# EAGLE design RTxManualControl (EAGLE 6.5.0)
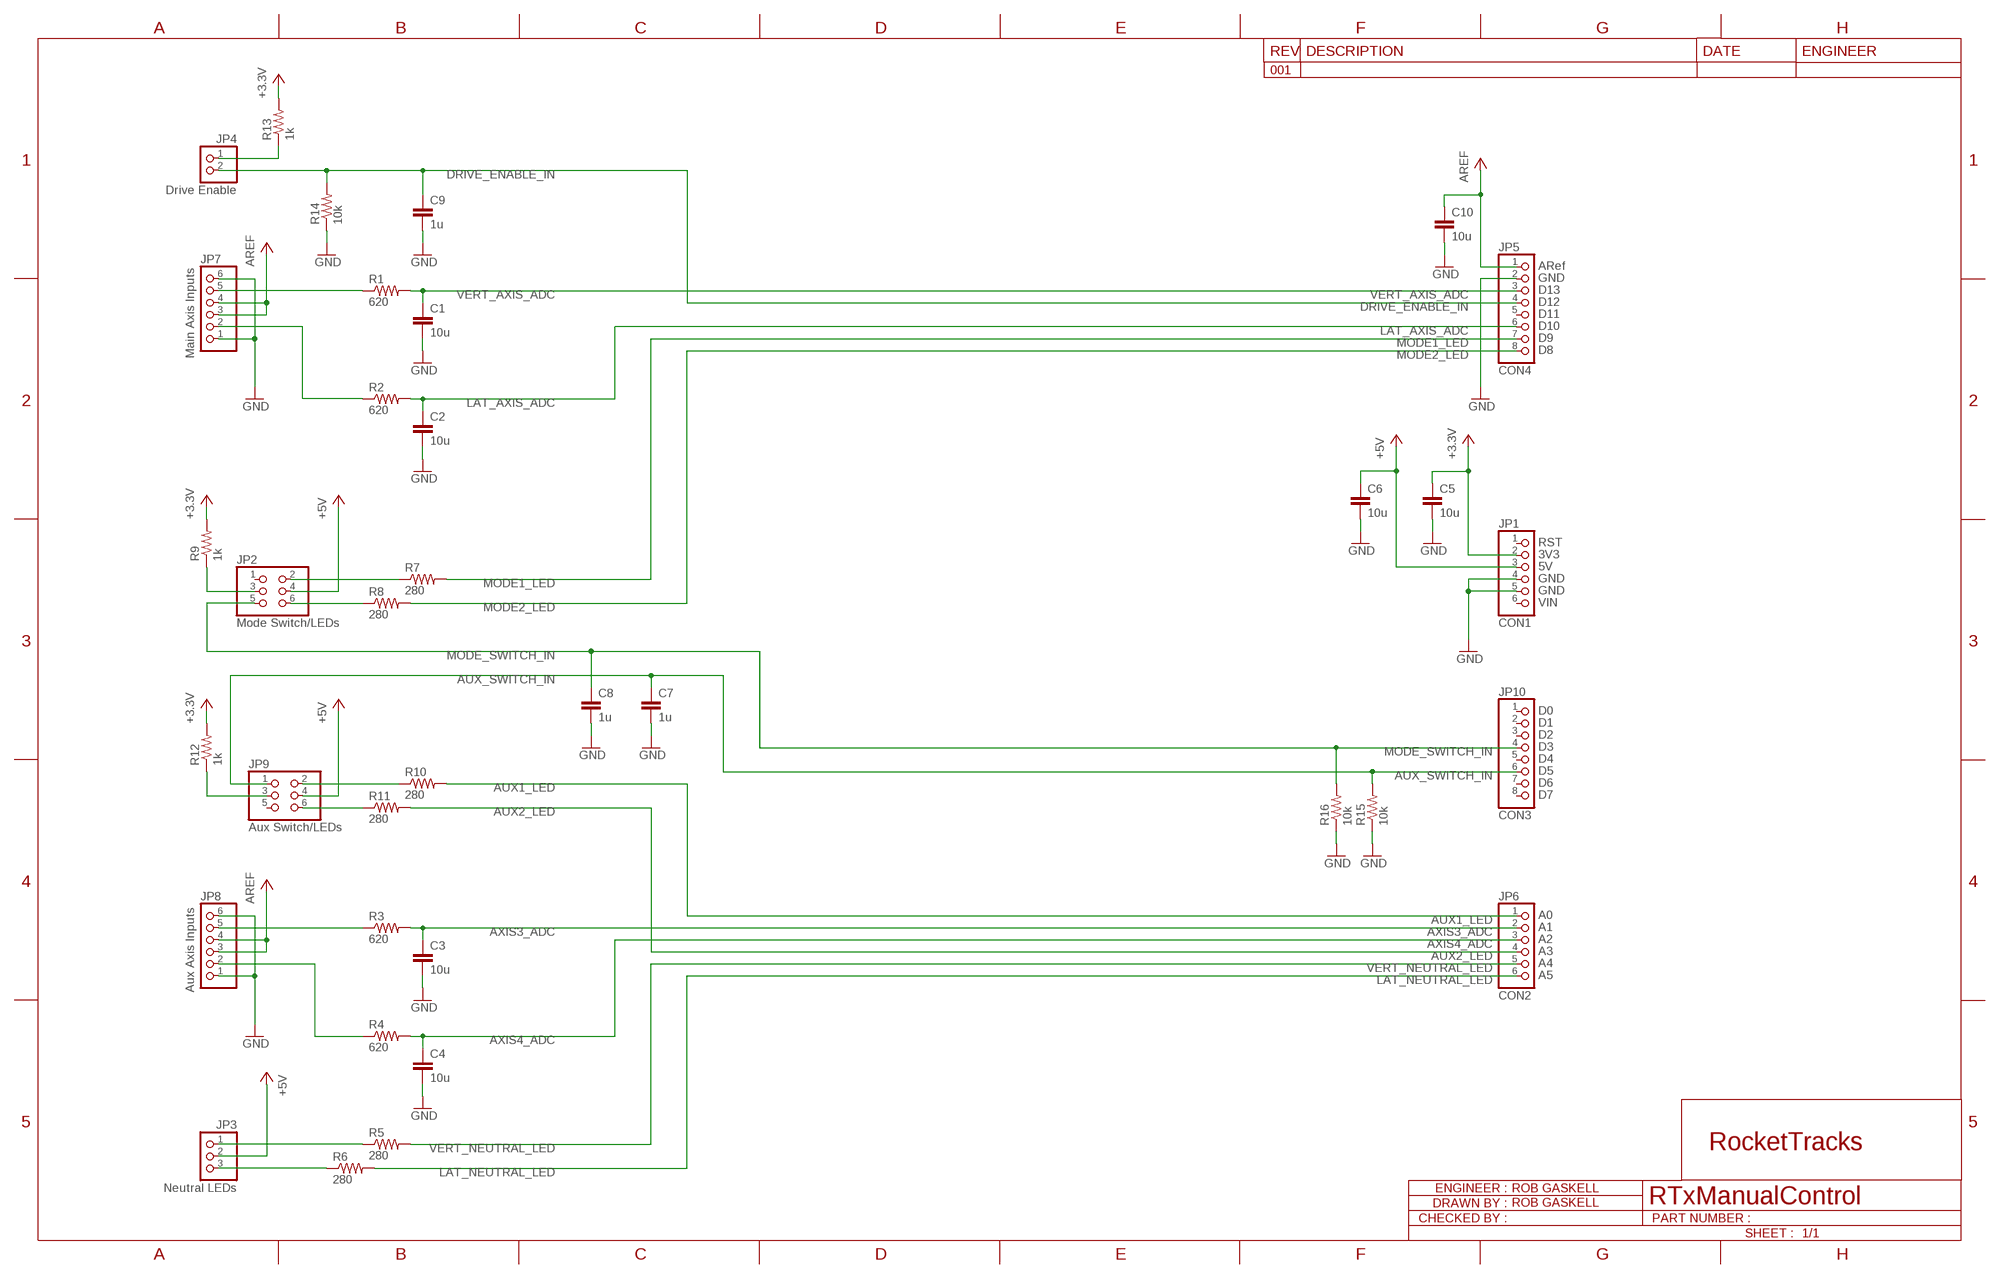
[diagram p0: schematic, sheet 1]

## Parts
C1  10u  C-EUC1206  [C1206]
C2  10u  C-EUC1206  [C1206]
C3  10u  C-EUC1206  [C1206]
C4  10u  C-EUC1206  [C1206]
C5  10u  C-EUC1206  [C1206]
C6  10u  C-EUC1206  [C1206]
C7  1u  C-EUC1206  [C1206]
C8  1u  C-EUC1206  [C1206]
C9  1u  C-EUC1206  [C1206]
C10  10u  C-EUC1206  [C1206]
JP1  CON1  PINHD-1X6  [1X06]
JP2  Mode Switch/LEDs  PINHD-2X3  [2X03]
JP3  Neutral LEDs  PINHD-1X3  [1X03]
JP4  Drive Enable  PINHD-1X2  [1X02]
JP5  CON4  PINHD-1X8  [1X08]
JP6  CON2  PINHD-1X6  [1X06]
JP7  Main Axis Inputs  PINHD-1X6  [1X06]
JP8  Aux Axis Inputs  PINHD-1X6  [1X06]
JP9  Aux Switch/LEDs  PINHD-2X3  [2X03]
JP10  CON3  PINHD-1X8  [1X08]
R1  620  R-US_R1206  [R1206]
R2  620  R-US_R1206  [R1206]
R3  620  R-US_R1206  [R1206]
R4  620  R-US_R1206  [R1206]
R5  280  R-US_R1206  [R1206]
R6  280  R-US_R1206  [R1206]
R7  280  R-US_R1206  [R1206]
R8  280  R-US_R1206  [R1206]
R9  1k  R-US_R1206  [R1206]
R10  280  R-US_R1206  [R1206]
R11  280  R-US_R1206  [R1206]
R12  1k  R-US_R1206  [R1206]
R13  1k  R-US_R1206  [R1206]
R14  10k  R-US_R1206  [R1206]
R15  10k  R-US_R1206  [R1206]
R16  10k  R-US_R1206  [R1206]

## Nets
+3.3V: C5.1 JP1.2 R9.2 R12.2 R13.2
+5V: C6.1 JP1.3 JP2.4 JP3.2 JP9.4
AREF: C10.1 JP5.1 JP7.3 JP7.4 JP8.3 JP8.4
AUX1_LED: JP6.1 R10.2
AUX1_LED_CONN: JP9.2 R10.1
AUX2_LED: JP6.4 R11.2
AUX2_LED_CONN: JP9.6 R11.1
AUX_SWITCH_IN: C7.1 JP9.1 JP10.6 R15.2
AUX_SWITCH_PULLUP: JP9.3 R12.1
AXIS3_ADC: C3.1 JP6.2 R3.2
AXIS3_CONN: JP8.5 R3.1
AXIS4_ADC: C4.1 JP6.3 R4.2
AXIS4_CONN: JP8.2 R4.1
DRIVE_ENABLE_IN: C9.1 JP4.2 JP5.4 R14.2
DRIVE_ENABLE_PULLUP: JP4.1 R13.1
GND: C1.2 C2.2 C3.2 C4.2 C5.2 C6.2 C7.2 C8.2 C9.2 C10.2 JP1.4 JP1.5 JP5.2 JP7.1 JP7.6 JP8.1 JP8.6 R14.1 R15.1 R16.1
LAT_AXIS_ADC: C2.1 JP5.6 R2.2
LAT_AXIS_CONN: JP7.2 R2.1
LAT_NEAUTRAL_LED_CONN: JP3.3 R6.1
LAT_NEUTRAL_LED: JP6.6 R6.2
MODE1_LED: JP5.7 R7.2
MODE1_LED_CONN: JP2.2 R7.1
MODE2_LED: JP5.8 R8.2
MODE2_LED_CONN: JP2.6 R8.1
MODE_SWITCH_IN: C8.1 JP2.5 JP10.4 R16.2
MODE_SWITCH_PULLUP: JP2.3 R9.1
VERT_AXIS_ADC: C1.1 JP5.3 R1.2
VERT_AXIS_CONN: JP7.5 R1.1
VERT_NEUTRAL_LED: JP6.5 R5.2
VERT_NEUTRAL_LED_CONN: JP3.1 R5.1
Unconnected: JP1.1 JP1.6 JP2.1 JP5.5 JP9.5 JP10.1 JP10.2 JP10.3 JP10.5 JP10.7 JP10.8

## Notes on the sheet
- ARef
- GND
- D13
- D12
- D11
- D10
- D9
- D8
- RST
- 3V3
- 5V
- GND
- GND
- VIN
- D0
- D1
- D2
- D3
- D4
- D5
- D6
- D7
- A0
- A1
- A2
- A3
- A4
- A5

## Library data of the parts
C1-C10 = rcl:C-EU: CAPACITOR, European symbol
JP1 JP6-JP8 = pinhead:PINHD-1X6: PIN HEADER
JP2 JP9 = pinhead:PINHD-2X3: PIN HEADER
JP3 = pinhead:PINHD-1X3: PIN HEADER
JP4 = pinhead:PINHD-1X2: PIN HEADER
JP5 JP10 = pinhead:PINHD-1X8: PIN HEADER
R1-R16 = rcl:R-US_: RESISTOR, American symbol

## Board
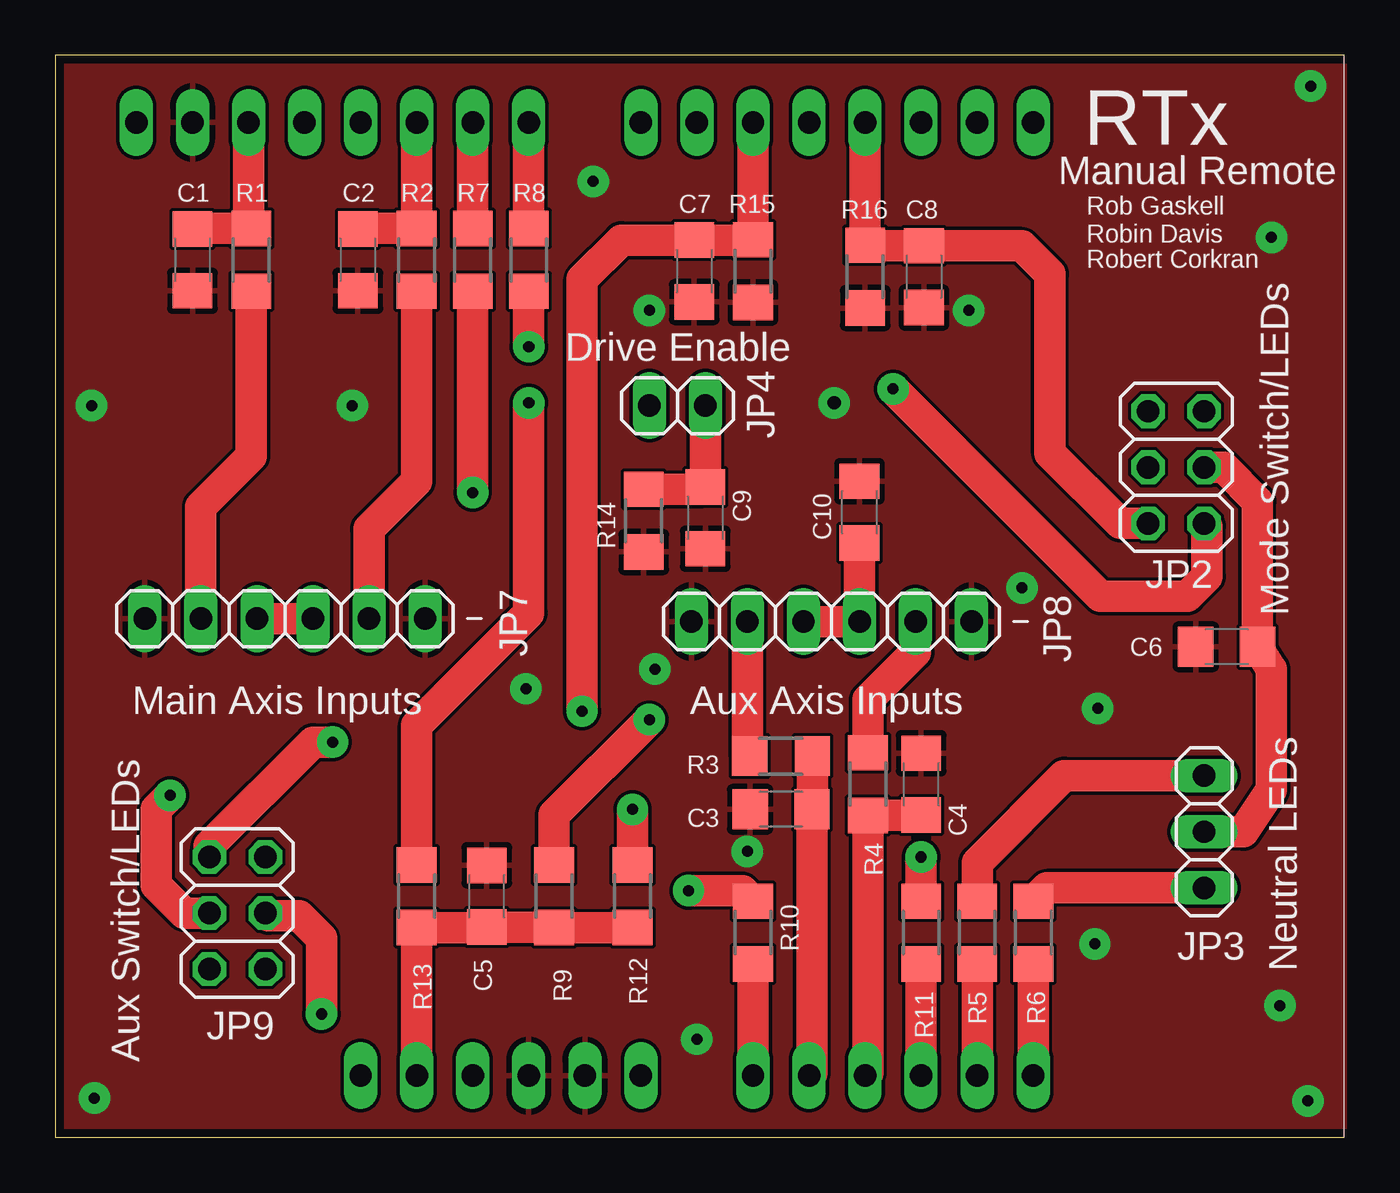
[diagram p1: board, top side]
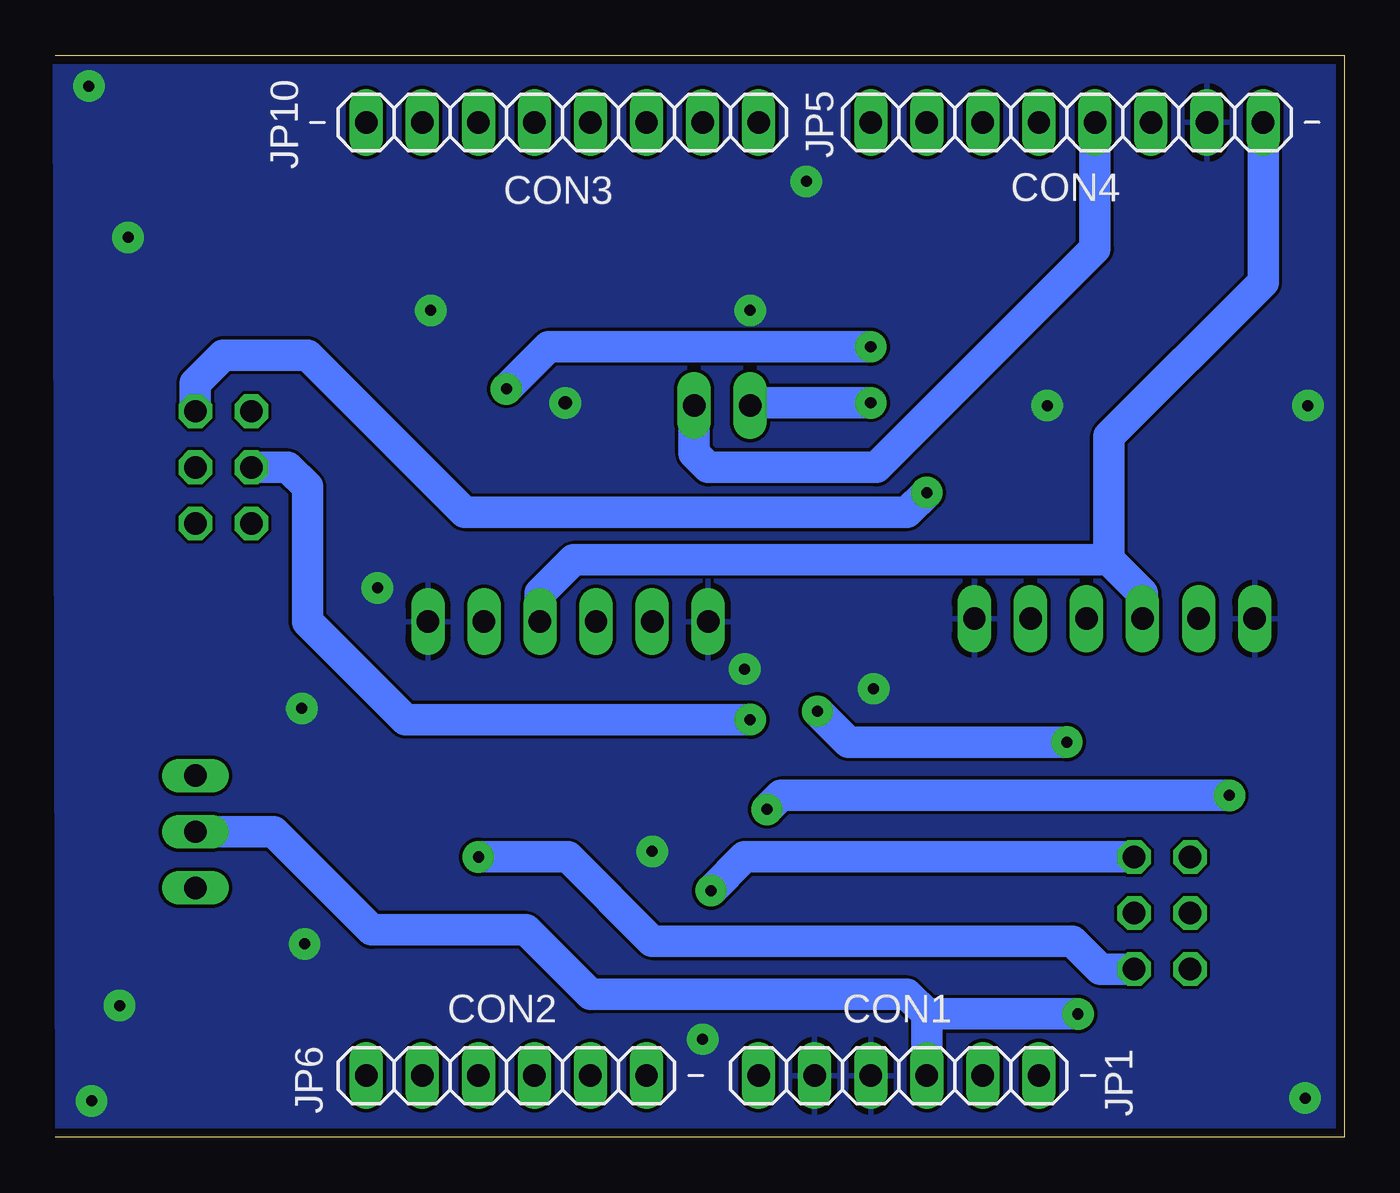
[diagram p2: board, bottom side, seen from below]

Size 58.42 x 49.02 mm. Coordinates in mm from the lower left corner, seen from the top.
Outline: 58.42,0 0,0 0,49.02 58.42,49.02
Copper layers (1*16): Top 0.0356mm / dielectric 1.5011mm / Bottom 0.0356mm
Design rules "osh-park-2layer *": minimum track width 6mil, minimum drill 13mil, track to track 6mil, track to pad 6mil, pad to pad 6mil, via to via 6mil, smd to smd 6mil, copper to edge 15mil, drill to drill 6mil, minimum pad ring 7mil, minimum via ring 7mil, stop-mask expansion 3mil, vias tented up to drill 30mil, thermal gap 10mil

### Footprints (pad centres in the part's own frame; a part is rotated, then mirrored left to right if it is on the bottom)
C1206 = smd 1.6 x 1.8: 1 -1.4,0; 2 1.4,0
1X06 = drill 1.016 long: 1 -6.35,0; 2 -3.81,0; 3 -1.27,0; 4 1.27,0; 5 3.81,0; 6 6.35,0
2X03 = drill 1.016 octagon: 1 -2.54,-1.27; 2 -2.54,1.27; 3 0,-1.27; 4 0,1.27; 5 2.54,-1.27; 6 2.54,1.27
1X03 = drill 1.016 long: 1 -2.54,0; 2 0,0; 3 2.54,0
1X02 = drill 1.016 long: 1 -1.27,0; 2 1.27,0
1X08 = drill 1.016 long: 1 -8.89,0; 2 -6.35,0; 3 -3.81,0; 4 -1.27,0; 5 1.27,0; 6 3.81,0; 7 6.35,0; 8 8.89,0
R1206 = smd 1.6 x 1.803: 1 -1.422,0; 2 1.422,0

### Placement (x,y rotation side)
C1  6.22,39.75 270 top
C2  13.72,39.75 270 top
C3  32.89,14.86 180 top
C4  39.24,16 90 top
C5  19.56,10.92 90 top
C6  53.09,22.23 180 top
C7  28.96,39.24 270 top
C8  39.37,38.99 270 top
C9  29.46,28.07 270 top
C10  36.45,28.32 90 top
JP1  20.19,2.79 180 bottom
JP2  50.8,30.35 270 top
JP3  52.07,13.84 270 top
JP4  28.19,33.15 0 top
JP5  12.57,45.97 180 bottom
JP6  37.97,2.79 180 bottom
JP7  10.41,23.5 180 top
JP8  35.18,23.37 180 top
JP9  8.26,10.16 270 top
JP10  35.43,45.97 0 bottom
R1  8.89,39.75 90 top
R2  16.38,39.75 90 top
R3  32.89,17.27 0 top
R4  36.83,16 270 top
R5  41.78,9.27 270 top
R6  44.32,9.27 270 top
R7  18.92,39.75 90 top
R8  21.46,39.75 90 top
R9  22.61,10.92 270 top
R10  31.62,9.27 270 top
R11  39.24,9.27 270 top
R12  26.16,10.92 270 top
R13  16.38,10.92 270 top
R14  26.67,27.94 90 top
R15  31.62,39.24 90 top
R16  36.7,38.99 90 top

### Tracks (layer width: path | path; a pad name or v marks a point on that pad's centre or on a via)
+3.3V
  Top 1.422: JP1.2 R13.2 19.54,9.5 C5.1 22.58,9.52 R9.2 R12.2
+5V  (via drill 0.5 pad 1.42)
  Top 1.422: v12.06,5.59 12.06,9.02 11.05,10.03 9.65,10.03 JP9.4 | JP2.4 52.96,30.35 54.49,28.83 C6.1 55.12,21.21 55.12,15.75 53.85,13.84 JP3.2
  Bottom 1.422: JP3.2 48.51,13.84 44.07,9.4 37.08,9.4 34.16,6.48 19.81,6.48 18.92,5.59 | 18.92,5.59 JP1.3 | 18.92,5.59 v12.06,5.59
AREF
  Top 1.422: C10.1 JP8.3 JP8.4 | JP7.4 JP7.3
  Bottom 1.422: JP7.4 9.14,24.64 10.67,26.16 | 10.67,26.16 34.92,26.16 36.45,24.64 JP8.3 | 10.67,26.16 10.67,31.75 3.68,38.73 JP5.1
AUX1_LED
  Top 1.422: R10.2 JP6.1
AUX1_LED_CONN  (via drill 0.5 pad 1.42)
  Top 1.422: R10.1 31.14,11.18 v28.7,11.18
  Bottom 1.422: JP9.2 27.18,12.7 v28.7,11.18
AUX2_LED
  Top 1.422: R11.2 JP6.4
AUX2_LED_CONN  (via drill 0.5 pad 1.42)
  Top 1.422: R11.1 v39.24,12.7
  Bottom 1.422: v39.24,12.7 35.18,12.7 31.37,8.89 12.32,8.89 11.05,7.62 JP9.6
AUX_SWITCH_IN  (via drill 0.5 pad 1.42)
  Top 1.422: v23.88,19.3 23.88,38.86 25.66,40.64 C7.1 31.6,40.64 R15.2 JP10.6 | JP9.1 6.99,13.21 11.68,17.91 v12.57,17.91
  Bottom 1.422: v12.57,17.91 22.48,17.91 v23.88,19.3
AUX_SWITCH_PULLUP  (via drill 0.5 pad 1.42)
  Top 1.422: JP9.3 5.84,10.16 4.57,11.43 4.57,14.86 v5.21,15.49 | v26.16,14.86 R12.1
  Bottom 1.422: v5.21,15.49 25.53,15.49 v26.16,14.86
AXIS3_ADC
  Top 1.422: JP6.2 34.29,2.92 C3.1 34.31,14.88 R3.2
AXIS3_CONN
  Top 1.422: R3.1 31.37,17.37 JP8.5
AXIS4_ADC
  Top 1.422: JP6.3 36.83,2.92 R4.2 36.85,14.6 C4.1
AXIS4_CONN
  Top 1.422: JP8.2 38.99,21.97 36.83,19.81 R4.1
DRIVE_ENABLE_IN
  Top 1.422: R14.2 29.36,29.36 C9.1 JP4.2
  Bottom 1.422: JP4.2 29.46,30.99 28.83,30.35 21.21,30.35 11.3,40.26 JP5.4
DRIVE_ENABLE_PULLUP  (via drill 0.5 pad 1.42)
  Top 1.422: R13.1 16.38,18.67 21.46,23.75 v21.46,33.27
  Bottom 1.422: v21.46,33.27 26.8,33.27 JP4.1
GND  (via drill 0.5 pad 1.42, 0.6 pad 1.42)
  other vias: 1.65,33.15 47.12,8.76 55.5,5.97 41.4,37.47 13.46,33.15 24.38,43.31 29.08,4.45 27.18,21.21 21.34,20.32 47.24,19.43 31.37,12.95 35.31,33.27 26.92,37.47 55.12,40.77 1.78,1.78 56.77,1.65 56.9,47.62 43.81,24.89
  pour Bottom: 0,0 58.29,0 58.42,49.02 0.13,49.02
  pour Top: 0.13,0 58.42,0 58.42,49.02 0.13,49.02
LAT_AXIS_ADC
  Top 1.422: JP5.6 R2.2 13.74,41.17 C2.1
LAT_AXIS_CONN
  Top 1.422: R2.1 16.38,29.72 14.22,27.56 JP7.2
LAT_NEAUTRAL_LED_CONN
  Top 1.422: JP3.3 44.93,11.3 R6.1
LAT_NEUTRAL_LED
  Top 1.422: JP6.6 R6.2
MODE1_LED
  Top 1.422: JP5.7 R7.2
MODE1_LED_CONN  (via drill 0.5 pad 1.42)
  Top 1.422: R7.1 v18.92,29.21
  Bottom 1.422: v18.92,29.21 19.81,28.32 39.88,28.32 46.99,35.43 50.8,35.43 52.07,34.16 JP2.2
MODE2_LED
  Top 1.422: JP5.8 R8.2
MODE2_LED_CONN  (via drill 0.5 pad 1.42)
  Top 1.422: R8.1 v21.46,35.81 | v37.97,33.91 47.37,24.51 51.31,24.51 52.2,25.4 52.2,27.69 JP2.6
  Bottom 1.422: v21.46,35.81 36.07,35.81 v37.97,33.91
MODE_SWITCH_IN
  Top 1.422: JP2.5 48.26,27.81 45.09,30.99 45.09,39.12 43.81,40.39 C8.1 36.73,40.39 R16.2 JP10.4
MODE_SWITCH_PULLUP  (via drill 0.5 pad 1.42)
  Top 1.422: R9.1 22.61,14.61 v26.92,18.92
  Bottom 1.422: v26.92,18.92 42.55,18.92 46.99,23.37 46.99,29.46 47.88,30.35 JP2.3
VERT_AXIS_ADC
  Top 1.422: JP5.3 8.76,41.3 R1.2 6.25,41.17 C1.1
VERT_AXIS_CONN
  Top 1.422: R1.1 8.89,30.86 6.6,28.57 JP7.5
VERT_NEUTRAL_LED
  Top 1.422: JP6.5 R5.2
VERT_NEUTRAL_LED_CONN
  Top 1.422: R5.1 41.78,12.45 45.72,16.38 JP3.1

### Text on the board
tPlace: RTx | Manual Remote | Rob Gaskell | Robin Davis | Robert Corkran